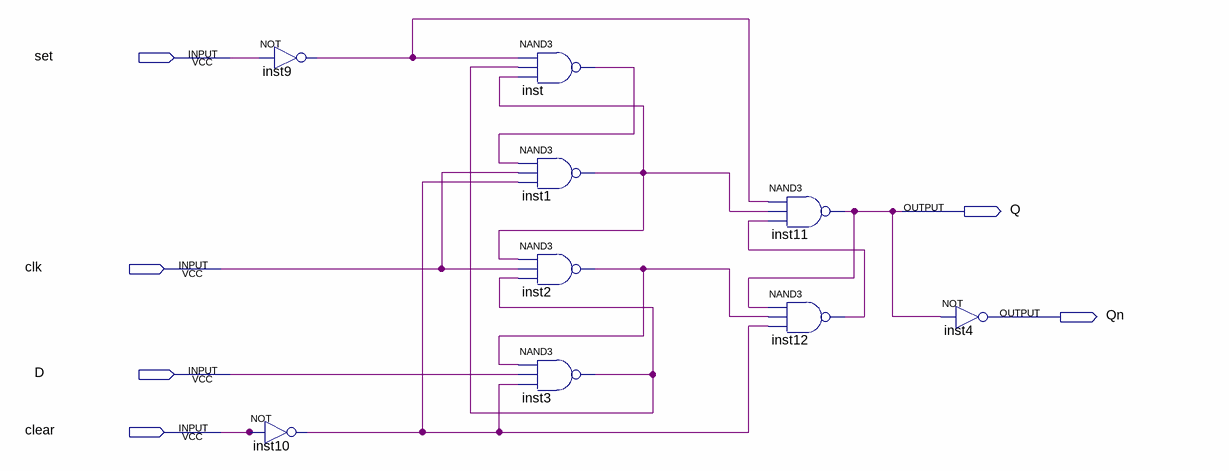
[diagram p0: schematic sheet]
// Quartus schematic Dflipflop.bdf as structural Verilog: 9 symbols, 6 pins
module Dflipflop (
  input  set,
  input  clk,
  input  D,
  input  clear,
  output Q,
  output Qn
);

  wire inst1_out, inst2_out, inst3_out, inst9_out, inst10_out, inst12_out, inst_out;

  not inst9 (inst9_out, set);
  not inst10 (inst10_out, clear);
  nand inst (inst_out, inst9_out, inst3_out, inst1_out);
  nand inst1 (inst1_out, inst_out, clk, inst10_out);
  nand inst2 (inst2_out, inst1_out, clk, inst3_out);
  nand inst3 (inst3_out, inst2_out, D, inst10_out);
  nand inst11 (Q, inst9_out, inst1_out, inst12_out);
  nand inst12 (inst12_out, Q, inst2_out, inst10_out);
  not inst4 (Qn, Q);
endmodule
